# Altium schematic sheet 01 - rpiInterface.SchDoc: Raspberry Pi Interface
size A4; DrawnBy: Trevor Charmley; Engineer: Trevor Charmley; DocumentNumber: 3; Revision: 1; SheetNumber: 3; SheetTotal: 8
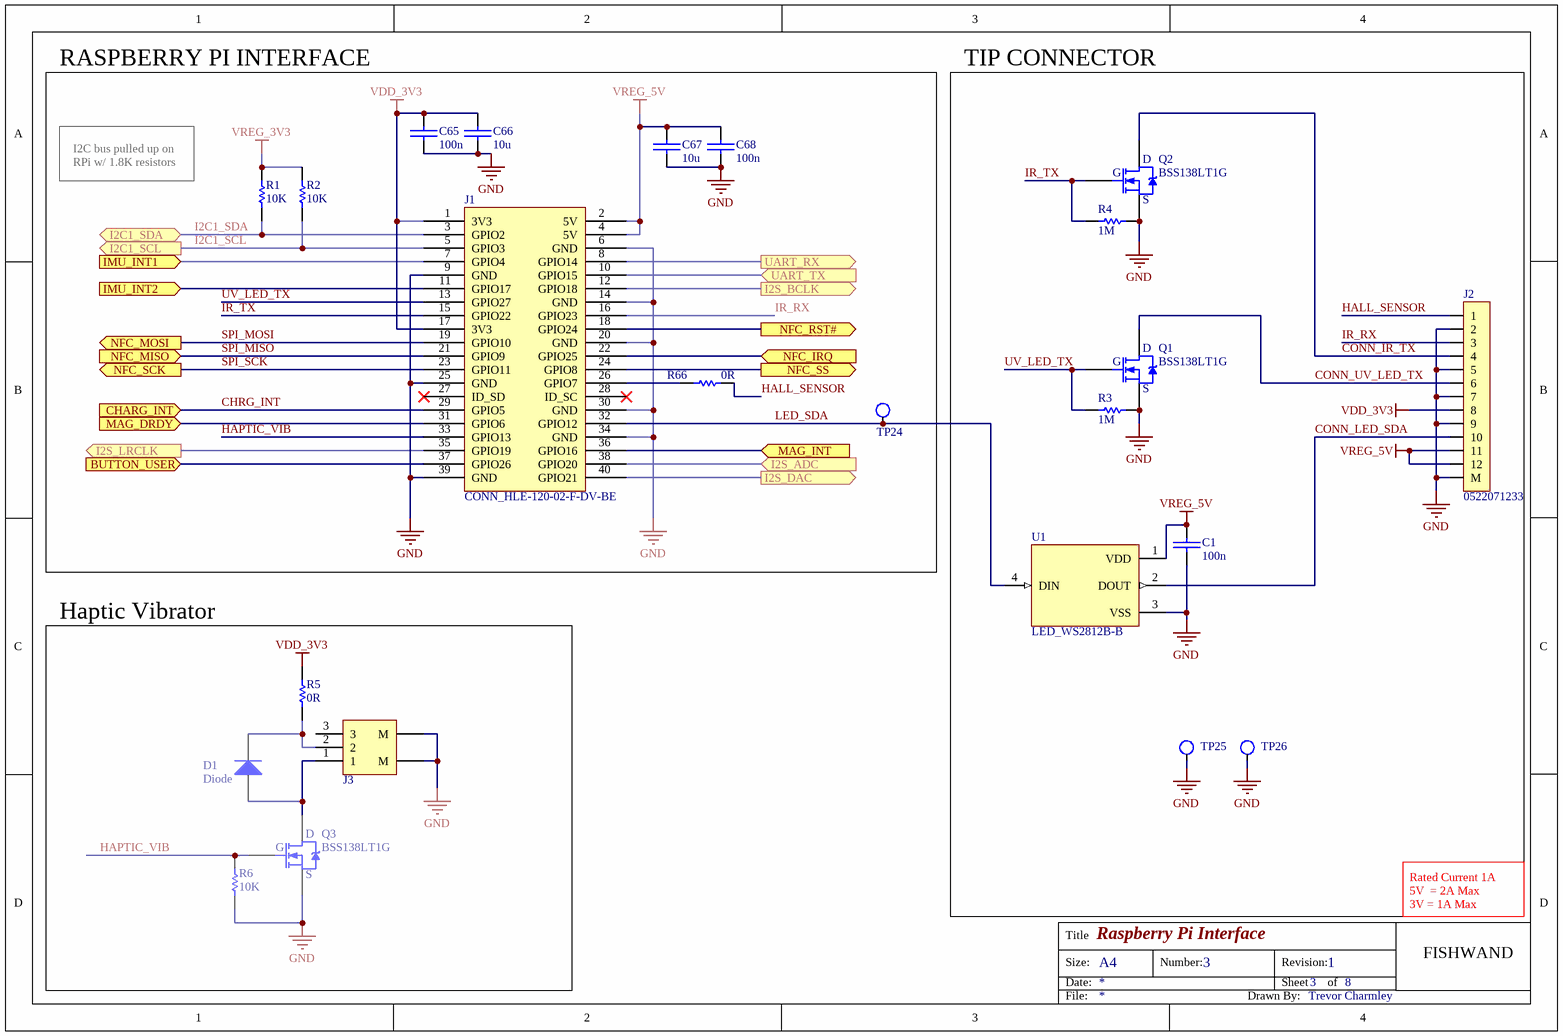
[diagram p0: 01 - rpiInterface.SchDoc]

## Parts
C1  100n  [CAPC100X50X65]
C65  100n  [CAPC100X50X65]
C66  10u  [CAPC100X50X65]
C67  10u  [CAPC100X50X65]
C68  100n  [CAPC100X50X65]
D1  Diode  [D_SOD_323F]
J1  CONN_HLE-120-02-F-DV-BE  [SAMTEC_HLE-120-02-F-DV-BE]
J2  0522071233  [CONN_0522711279]
J3  BM03B-ADHKS-GAN-ETB  [J_JST_BM03B-ADHKS-GAN-ETB]  (value not drawn)
Q1  BSS138LT1G  [SOT23-3P95_240X111L42X43N]
Q2  BSS138LT1G  [SOT23-3P95_240X111L42X43N]
Q3  BSS138LT1G  [SOT23-3P95_240X111L42X43N]
R1  10K  [RESC0402]
R2  10K  [RESC0402]
R3  1M  [RESC0402]
R4  1M  [RESC0402]
R5  0R  [RESC0402]
R6  10K  [RESC0402]
R66  0R  [RESC0402]
TP24  Test Point  [tp_1mm]  (value not drawn)  (no BOM)
TP25  Test Point  [tp_1mm]  (value not drawn)  (no BOM)
TP26  Test Point  [tp_1mm]  (value not drawn)  (no BOM)
U1  LED_WS2812B-B  [LED_WS2812B-B]

## Blocks framed on the sheet
RASPBERRY PI INTERFACE: C65-C68 J1 R1 R2 R66 TP24
TIP CONNECTOR: C1 J2 Q1 Q2 R3 R4 TP25 TP26 U1
Haptic Vibrator: D1 J3 Q3 R5 R6

## Ports
BUTTON_USER (in), CHARG_INT (in), I2C1_SCL (out), I2C1_SDA (bidir), I2S_ADC (in), I2S_BCLK (out), I2S_DAC (out), I2S_LRCLK (out), IMU_INT1 (in), IMU_INT2 (in), MAG_DRDY (in), MAG_INT (in), NFC_IRQ (in), NFC_MISO (in), NFC_MOSI (out), NFC_RST# (out), NFC_SCK (out), NFC_SS (out), UART_RX (out), UART_TX (in)

## Nets
GND: C1.2 C65.2 C66.2 C67.2 C68.2 J1.6(GND) J1.9(GND) J1.14(GND) J1.20(GND) J1.25(GND) J1.30(GND) J1.34(GND) J1.39(GND) J2.2 J2.5 J2.7 J2.9 J2.M J3.0(M) Q1.2(S) Q2.2(S) Q3.2(S) R3.1 R4.1 R6.1 TP25.1 TP26.1 U1.3(VSS)
VDD_3V3: C65.1 C66.1 J1.1(3V3) J1.17(3V3) J2.8 R5.2
VREG_3V3: R1.2 R2.2
VREG_5V: C1.1 C67.1 C68.1 J1.2(5V) J1.4(5V) J2.11 J2.12 U1.1(VDD)
BUTTON_USER: J1.37(GPIO26) ; port BUTTON_USER
CHRG_INT: J1.29(GPIO5) ; port CHARG_INT
CONN_IR_TX: J2.4 Q2.3(D)
CONN_LED_SDA: J2.10 U1.2(DOUT)
CONN_UV_LED_TX: J2.6 Q1.3(D)
HALL_SENSOR: J2.1 R66.2
HAPTIC_VIB: J1.33(GPIO13) Q3.1(G) R6.2
I2C1_SCL: J1.5(GPIO3) R2.1 ; port I2C1_SCL
I2C1_SDA: J1.3(GPIO2) R1.1 ; port I2C1_SDA
I2S_ADC: J1.38(GPIO20) ; port I2S_ADC
I2S_BCLK: J1.12(GPIO18) ; port I2S_BCLK
I2S_DAC: J1.40(GPIO21) ; port I2S_DAC
I2S_LRCLK: J1.35(GPIO19) ; port I2S_LRCLK
IMU_INT1: J1.7(GPIO4) ; port IMU_INT1
IMU_INT2: J1.11(GPIO17) ; port IMU_INT2
IR_RX: J1.16(GPIO23) J2.3
IR_TX: J1.15(GPIO22) Q2.1(G) R4.2
LED_SDA: J1.32(GPIO12) TP24.1 U1.4(DIN)
MAG_DRDY: J1.31(GPIO6) ; port MAG_DRDY
MAG_INT: J1.36(GPIO16) ; port MAG_INT
NFC_IRQ: J1.22(GPIO25) ; port NFC_IRQ
NFC_RST#: J1.18(GPIO24) ; port NFC_RST#
NFC_SS: J1.24(GPIO8) ; port NFC_SS
SPI_MISO: J1.21(GPIO9) ; port NFC_MISO
SPI_MOSI: J1.19(GPIO10) ; port NFC_MOSI
SPI_SCK: J1.23(GPIO11) ; port NFC_SCK
UART_RX: J1.8(GPIO14) ; port UART_RX
UART_TX: J1.10(GPIO15) ; port UART_TX
UV_LED_TX: J1.13(GPIO27) Q1.1(G) R3.2
NetD1_1: D1.1(K) J3.2 R5.1
NetD1_2: D1.2(A) J3.1 Q3.3(D)
NetJ1_26: J1.26(GPIO7) R66.1

Not connected (* = marked no-connect by the designer): J1 27(ID_SD)* 28(ID_SC)*; J3 3

## Notes on the sheet
- I2C bus pulled up on RPi w/ 1.8K resistors
- Rated Current 1A
  5V  = 2A Max
  3V = 1A Max
- Title
- Size:
- Date:
- A4
- Number:
- Revision:
- Sheet
- of
- FISHWAND
- File:
- Drawn By:

## Library data of the parts
C1 C65 C68 = C_100NF_25V_X5R_0402: CAP CER 100nF 25V X5R 0402; Manufacturer: Murata Electronics; Manufacturer PN: GRM155R61E104KA87D; Supplier: Digi-Key; Supplier PN: 490-5920-2-ND
C66 C67 = C_10UF_10V_X5R_0402: CAP CER 10UF 10V X5R 0402; Manufacturer: Samsung Electro-Mechanics; Manufacturer PN: CL05A106MP5NUNC; Supplier PN: 1276-1450-1-ND
D1 = D_SOD_323_75V_150mA: DIODE GEN PURP 75V 150MA SOD323F; Manufacturer: onsemi; Manufacturer PN: 1N4148WS; Supplier: *; Supplier PN: *; Package / Case: SC-90, SOD-323F
J1 = CONN_HLE-120-02-F-DV-BE: Manufacturer: Samtec; Manufacturer PN: HLE-120-02-F-DV-BE; Availability: Unavailable; Price: None; Value: *
J2 = CONN_FPC_Bottom 12POS_1MM_0522711279: CONN FPC BOTTOM 12POS 1.00MM R/A; Manufacturer: Molex; Manufacturer PN: 0522711279; Supplier: Digi-Key; Supplier PN: WM7960CT-ND; Package / Case: *
J3 = CONN _HEADER SMD_3POS_1.3MM: CONN HEADER SMD R/A 3POS 1.3MM; Manufacturer: JST Sales America Inc.; Manufacturer PN: BM03B-ADHKS-GAN-ETB; Supplier: Digi-Key; Supplier PN: 455-2900-1-ND; ComponentLink1Description: Datasheet; ComponentLink1URL: http://www.jst-mfg.com/product/pdf/eng/eADH.pdf
Q1-Q3 = TRANS_MOSFET_N_50V_200MA_SOT23: MOSFET N-CH 50V 200MA SOT-23; Manufacturer: ON Semiconductor; Manufacturer PN: BSS138LT1G; Type: MOSFET N-CH; Supplier PN: BSS138LT1GOSCT-ND
R1 R2 R6 = R_0402_10K_1%: 10 kOhms ±1% 0.063W, 1/16W Chip Resistor 0402 (1005 Metric) Moisture Resistant Thick Film; Manufacturer: YAGEO; Manufacturer PN: RC0402FR-0710KL; Supplier: *; Supplier PN: *; Value: 10K; Tolerance: 1%; Package / Case: 0402
R3 R4 = R_0402_1M_1%: 1 MOhms ±1% 0.063W, 1/16W Chip Resistor 0402 (1005 Metric) Moisture Resistant Thick Film; Manufacturer: YAGEO; Manufacturer PN: RC0402FR-071ML; Supplier: Digi-Key; Supplier PN: 311-1.00MLRTR-ND; Value: 1M; Tolerance: 1%; Package / Case: 0402
R5 R66 = R_0402_0R_5%: 0 Ohms Jumper 0.063W, 1/16W Chip Resistor 0402 (1005 Metric) Thick Film; Manufacturer: YAGEO; Manufacturer PN: RC0402JR-070RP; Tolerance: 5%; Supplier: *; Supplier PN: *; Value: 0R; Package / Case: 0402
TP24-TP26 = TP_1mm
U1 = LED_WS2812B-B: Intelligent control LED integrated light source; Manufacturer PN: WS2812B-V5; Manufacturer: Worldsemi; Package / Case: 5050; Value: *; Price: None; Availability: Unavailable